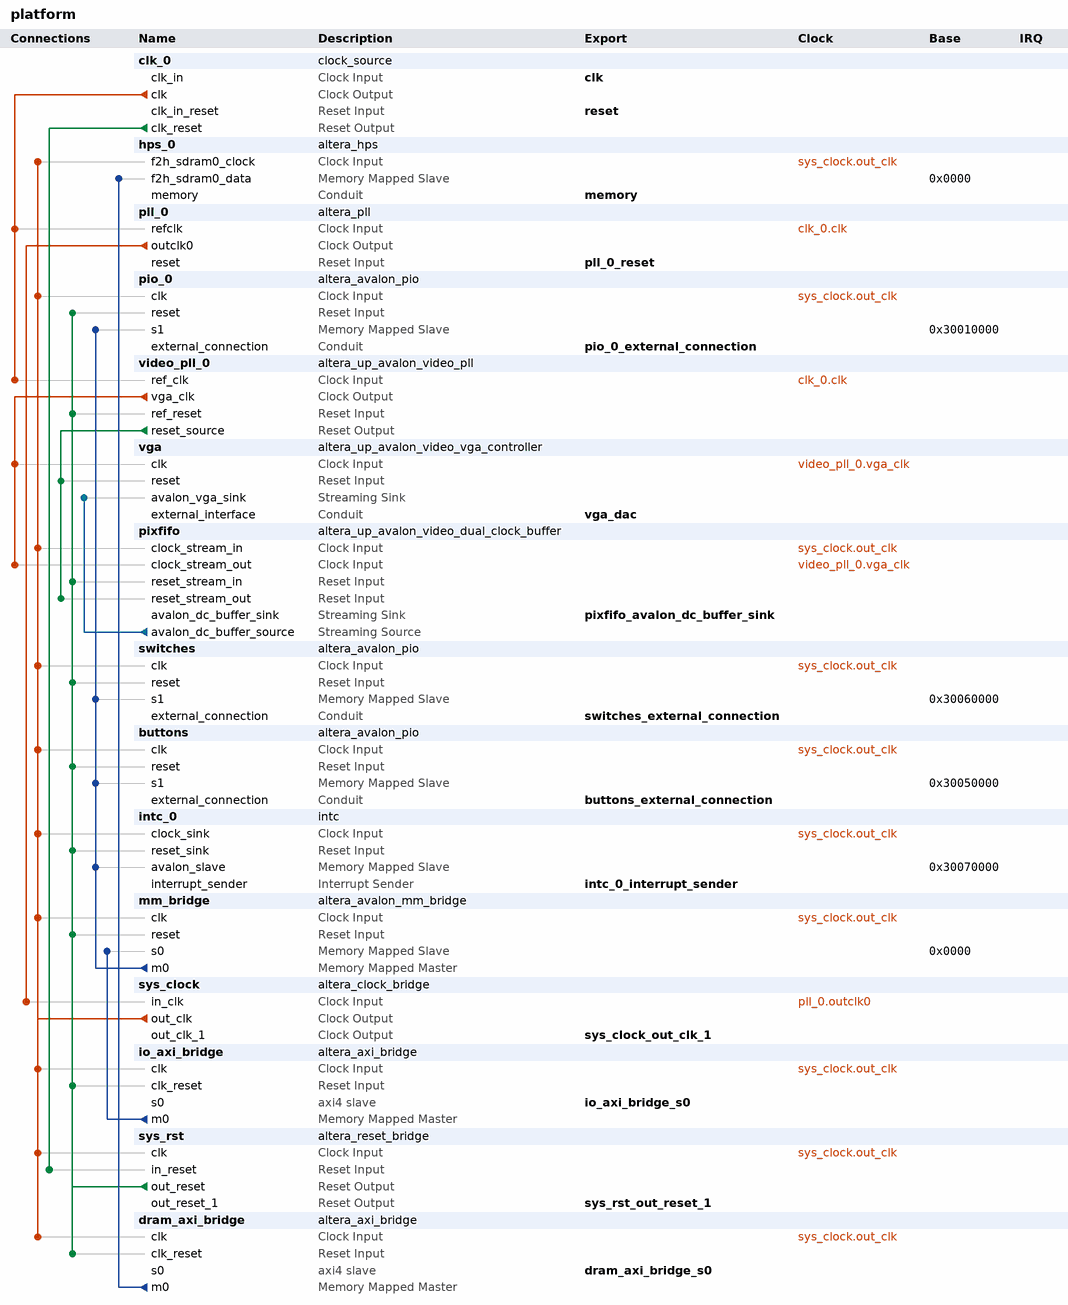
[diagram p0: system contents]
# Platform Designer (Qsys) system platform, Cyclone V 5CSEMA5F31C6
# Parameters at their usual value, and those the tool derives, are not listed.
package require -exact qsys 20.1
create_system platform
set_project_property DEVICE_FAMILY {Cyclone V}
set_project_property DEVICE 5CSEMA5F31C6

add_instance clk_0 clock_source 20.1
set_instance_parameter_value clk_0 clockFrequency 50000000

add_instance hps_0 altera_hps 20.1
set_instance_parameter_value hps_0 EMAC1_Mode N/A
set_instance_parameter_value hps_0 EMAC1_PinMuxing Unused
set_instance_parameter_value hps_0 F2SCLK_COLDRST_Enable false
set_instance_parameter_value hps_0 F2SCLK_DBGRST_Enable false
set_instance_parameter_value hps_0 F2SCLK_WARMRST_Enable false
set_instance_parameter_value hps_0 F2SDRAM_Type AXI-3
set_instance_parameter_value hps_0 F2SDRAM_Width 32
set_instance_parameter_value hps_0 F2SINTERRUPT_Enable false
set_instance_parameter_value hps_0 F2S_Width 0
set_instance_parameter_value hps_0 FPGA_PERIPHERAL_OUTPUT_CLOCK_FREQ_EMAC0_GTX_CLK 125
set_instance_parameter_value hps_0 FPGA_PERIPHERAL_OUTPUT_CLOCK_FREQ_EMAC0_MD_CLK 2.5
set_instance_parameter_value hps_0 FPGA_PERIPHERAL_OUTPUT_CLOCK_FREQ_EMAC1_GTX_CLK 125
set_instance_parameter_value hps_0 FPGA_PERIPHERAL_OUTPUT_CLOCK_FREQ_EMAC1_MD_CLK 2.5
set_instance_parameter_value hps_0 HPS_PROTOCOL DDR3
set_instance_parameter_value hps_0 I2C0_Mode N/A
set_instance_parameter_value hps_0 I2C0_PinMuxing Unused
set_instance_parameter_value hps_0 I2C1_Mode N/A
set_instance_parameter_value hps_0 I2C1_PinMuxing Unused
set_instance_parameter_value hps_0 LWH2F_Enable false
set_instance_parameter_value hps_0 MEM_BANKADDR_WIDTH 3
set_instance_parameter_value hps_0 MEM_CLK_FREQ 300.0
set_instance_parameter_value hps_0 MEM_CLK_FREQ_MAX 400.0
set_instance_parameter_value hps_0 MEM_COL_ADDR_WIDTH 8
set_instance_parameter_value hps_0 MEM_DQ_WIDTH 8
set_instance_parameter_value hps_0 MEM_DRV_STR RZQ/6
set_instance_parameter_value hps_0 MEM_ROW_ADDR_WIDTH 12
set_instance_parameter_value hps_0 MEM_RTT_NOM {ODT Disabled}
set_instance_parameter_value hps_0 MEM_RTT_WR {Dynamic ODT off}
set_instance_parameter_value hps_0 MEM_TCL 7
set_instance_parameter_value hps_0 MEM_TFAW_NS 37.5
set_instance_parameter_value hps_0 MEM_TINIT_US 499
set_instance_parameter_value hps_0 MEM_TMRD_CK 3
set_instance_parameter_value hps_0 MEM_TRAS_NS 40.0
set_instance_parameter_value hps_0 MEM_TRCD_NS 15.0
set_instance_parameter_value hps_0 MEM_TREFI_US 7.0
set_instance_parameter_value hps_0 MEM_TRFC_NS 75.0
set_instance_parameter_value hps_0 MEM_TRP_NS 15.0
set_instance_parameter_value hps_0 MEM_TWTR 2
set_instance_parameter_value hps_0 MEM_VENDOR JEDEC
set_instance_parameter_value hps_0 MEM_WTCL 6
set_instance_parameter_value hps_0 QSPI_Mode N/A
set_instance_parameter_value hps_0 QSPI_PinMuxing Unused
set_instance_parameter_value hps_0 REF_CLK_FREQ 125.0
set_instance_parameter_value hps_0 S2FCLK_USER2CLK 5
set_instance_parameter_value hps_0 S2F_Width 0
set_instance_parameter_value hps_0 SDIO_Mode N/A
set_instance_parameter_value hps_0 SDIO_PinMuxing Unused
set_instance_parameter_value hps_0 SPIM1_Mode N/A
set_instance_parameter_value hps_0 SPIM1_PinMuxing Unused
set_instance_parameter_value hps_0 STM_Enable false
set_instance_parameter_value hps_0 TIMING_BOARD_AC_SKEW 0.02
set_instance_parameter_value hps_0 TIMING_BOARD_AC_TO_CK_SKEW 0.0
set_instance_parameter_value hps_0 TIMING_BOARD_DQ_TO_DQS_SKEW 0.0
set_instance_parameter_value hps_0 TIMING_BOARD_MAX_CK_DELAY 0.6
set_instance_parameter_value hps_0 TIMING_BOARD_MAX_DQS_DELAY 0.6
set_instance_parameter_value hps_0 TIMING_BOARD_SKEW_BETWEEN_DQS 0.02
set_instance_parameter_value hps_0 TIMING_BOARD_SKEW_CKDQS_DIMM_MAX 0.01
set_instance_parameter_value hps_0 TIMING_BOARD_SKEW_CKDQS_DIMM_MIN -0.01
set_instance_parameter_value hps_0 TIMING_BOARD_SKEW_WITHIN_DQS 0.02
set_instance_parameter_value hps_0 TIMING_TDH 125
set_instance_parameter_value hps_0 TIMING_TDQSCK 400
set_instance_parameter_value hps_0 TIMING_TDQSQ 120
set_instance_parameter_value hps_0 TIMING_TDS 50
set_instance_parameter_value hps_0 TIMING_TIH 250
set_instance_parameter_value hps_0 TIMING_TIS 175
set_instance_parameter_value hps_0 TIMING_TQSH 0.38
set_instance_parameter_value hps_0 UART0_Mode N/A
set_instance_parameter_value hps_0 UART0_PinMuxing Unused
set_instance_parameter_value hps_0 USB1_Mode N/A
set_instance_parameter_value hps_0 USB1_PinMuxing Unused
set_instance_parameter_value hps_0 desired_cfg_clk_mhz 100.0
set_instance_parameter_value hps_0 desired_qspi_clk_mhz 400.0

add_instance pll_0 altera_pll 20.1
set_instance_parameter_value pll_0 gui_device_speed_grade 1
set_instance_parameter_value pll_0 gui_number_of_clocks 1
set_instance_parameter_value pll_0 gui_operation_mode direct
set_instance_parameter_value pll_0 gui_output_clock_frequency0 120.0
set_instance_parameter_value pll_0 gui_pll_auto_reset On
set_instance_parameter_value pll_0 gui_pll_mode {Fractional-N PLL}
set_instance_parameter_value pll_0 gui_reference_clock_frequency 50.0
set_instance_parameter_value pll_0 gui_use_locked false

add_instance pio_0 altera_avalon_pio 20.1
set_instance_parameter_value pio_0 bitModifyingOutReg true
set_instance_parameter_value pio_0 direction Output
set_instance_parameter_value pio_0 width 8

add_instance video_pll_0 altera_up_avalon_video_pll 18.0
set_instance_parameter_value video_pll_0 camera {5MP Digital Camera (THDB_D5M)}
set_instance_parameter_value video_pll_0 gui_refclk 50.0
set_instance_parameter_value video_pll_0 lcd {7" LCD on VEEK-MT and MTL/MTL2 Modules}

add_instance vga altera_up_avalon_video_vga_controller 18.0
set_instance_parameter_value vga board DE1-SoC
set_instance_parameter_value vga resolution {VGA 640x480}

add_instance pixfifo altera_up_avalon_video_dual_clock_buffer 18.0
set_instance_parameter_value pixfifo color_bits 10

add_instance switches altera_avalon_pio 20.1
set_instance_parameter_value switches direction Input
set_instance_parameter_value switches width 8

add_instance buttons altera_avalon_pio 20.1
set_instance_parameter_value buttons direction Input
set_instance_parameter_value buttons width 8

add_instance intc_0 intc 1.0

add_instance mm_bridge altera_avalon_mm_bridge 20.1
set_instance_parameter_value mm_bridge ADDRESS_UNITS SYMBOLS
set_instance_parameter_value mm_bridge ADDRESS_WIDTH 32
set_instance_parameter_value mm_bridge DATA_WIDTH 128
set_instance_parameter_value mm_bridge MAX_PENDING_RESPONSES 4
set_instance_parameter_value mm_bridge USE_AUTO_ADDRESS_WIDTH 0

add_instance sys_clock altera_clock_bridge 20.1
set_instance_parameter_value sys_clock DERIVED_CLOCK_RATE 120000000
set_instance_parameter_value sys_clock EXPLICIT_CLOCK_RATE 0
set_instance_parameter_value sys_clock NUM_CLOCK_OUTPUTS 2

add_instance io_axi_bridge altera_axi_bridge 20.1
set_instance_parameter_value io_axi_bridge ADDR_WIDTH 32
set_instance_parameter_value io_axi_bridge AXI_VERSION AXI4
set_instance_parameter_value io_axi_bridge COMBINED_ACCEPTANCE_CAPABILITY 16
set_instance_parameter_value io_axi_bridge COMBINED_ISSUING_CAPABILITY 16
set_instance_parameter_value io_axi_bridge DATA_WIDTH 32
set_instance_parameter_value io_axi_bridge M0_ID_WIDTH 8
set_instance_parameter_value io_axi_bridge READ_ACCEPTANCE_CAPABILITY 16
set_instance_parameter_value io_axi_bridge READ_ADDR_USER_WIDTH 1
set_instance_parameter_value io_axi_bridge READ_DATA_REORDERING_DEPTH 1
set_instance_parameter_value io_axi_bridge READ_DATA_USER_WIDTH 1
set_instance_parameter_value io_axi_bridge READ_ISSUING_CAPABILITY 16
set_instance_parameter_value io_axi_bridge S0_ID_WIDTH 8
set_instance_parameter_value io_axi_bridge USE_M0_ARBURST 1
set_instance_parameter_value io_axi_bridge USE_M0_ARCACHE 1
set_instance_parameter_value io_axi_bridge USE_M0_ARID 1
set_instance_parameter_value io_axi_bridge USE_M0_ARLEN 1
set_instance_parameter_value io_axi_bridge USE_M0_ARLOCK 1
set_instance_parameter_value io_axi_bridge USE_M0_ARQOS 1
set_instance_parameter_value io_axi_bridge USE_M0_ARREGION 1
set_instance_parameter_value io_axi_bridge USE_M0_ARSIZE 1
set_instance_parameter_value io_axi_bridge USE_M0_ARUSER 0
set_instance_parameter_value io_axi_bridge USE_M0_AWBURST 1
set_instance_parameter_value io_axi_bridge USE_M0_AWCACHE 1
set_instance_parameter_value io_axi_bridge USE_M0_AWID 1
set_instance_parameter_value io_axi_bridge USE_M0_AWLEN 1
set_instance_parameter_value io_axi_bridge USE_M0_AWLOCK 1
set_instance_parameter_value io_axi_bridge USE_M0_AWQOS 1
set_instance_parameter_value io_axi_bridge USE_M0_AWREGION 1
set_instance_parameter_value io_axi_bridge USE_M0_AWSIZE 1
set_instance_parameter_value io_axi_bridge USE_M0_AWUSER 0
set_instance_parameter_value io_axi_bridge USE_M0_BID 1
set_instance_parameter_value io_axi_bridge USE_M0_BRESP 1
set_instance_parameter_value io_axi_bridge USE_M0_BUSER 0
set_instance_parameter_value io_axi_bridge USE_M0_RID 1
set_instance_parameter_value io_axi_bridge USE_M0_RLAST 1
set_instance_parameter_value io_axi_bridge USE_M0_RRESP 1
set_instance_parameter_value io_axi_bridge USE_M0_RUSER 0
set_instance_parameter_value io_axi_bridge USE_M0_WSTRB 1
set_instance_parameter_value io_axi_bridge USE_M0_WUSER 0
set_instance_parameter_value io_axi_bridge USE_PIPELINE 1
set_instance_parameter_value io_axi_bridge USE_S0_ARCACHE 1
set_instance_parameter_value io_axi_bridge USE_S0_ARLOCK 1
set_instance_parameter_value io_axi_bridge USE_S0_ARPROT 1
set_instance_parameter_value io_axi_bridge USE_S0_ARQOS 1
set_instance_parameter_value io_axi_bridge USE_S0_ARREGION 1
set_instance_parameter_value io_axi_bridge USE_S0_ARUSER 0
set_instance_parameter_value io_axi_bridge USE_S0_AWCACHE 1
set_instance_parameter_value io_axi_bridge USE_S0_AWLOCK 1
set_instance_parameter_value io_axi_bridge USE_S0_AWPROT 1
set_instance_parameter_value io_axi_bridge USE_S0_AWQOS 1
set_instance_parameter_value io_axi_bridge USE_S0_AWREGION 1
set_instance_parameter_value io_axi_bridge USE_S0_AWUSER 0
set_instance_parameter_value io_axi_bridge USE_S0_BRESP 1
set_instance_parameter_value io_axi_bridge USE_S0_BUSER 0
set_instance_parameter_value io_axi_bridge USE_S0_RRESP 1
set_instance_parameter_value io_axi_bridge USE_S0_RUSER 0
set_instance_parameter_value io_axi_bridge USE_S0_WLAST 1
set_instance_parameter_value io_axi_bridge USE_S0_WUSER 0
set_instance_parameter_value io_axi_bridge WRITE_ACCEPTANCE_CAPABILITY 16
set_instance_parameter_value io_axi_bridge WRITE_ADDR_USER_WIDTH 1
set_instance_parameter_value io_axi_bridge WRITE_DATA_USER_WIDTH 1
set_instance_parameter_value io_axi_bridge WRITE_ISSUING_CAPABILITY 16
set_instance_parameter_value io_axi_bridge WRITE_RESP_USER_WIDTH 1

add_instance sys_rst altera_reset_bridge 20.1
set_instance_parameter_value sys_rst ACTIVE_LOW_RESET 1
set_instance_parameter_value sys_rst NUM_RESET_OUTPUTS 2
set_instance_parameter_value sys_rst SYNCHRONOUS_EDGES deassert

add_instance dram_axi_bridge altera_axi_bridge 20.1
set_instance_parameter_value dram_axi_bridge ADDR_WIDTH 32
set_instance_parameter_value dram_axi_bridge AXI_VERSION AXI4
set_instance_parameter_value dram_axi_bridge COMBINED_ACCEPTANCE_CAPABILITY 16
set_instance_parameter_value dram_axi_bridge COMBINED_ISSUING_CAPABILITY 16
set_instance_parameter_value dram_axi_bridge DATA_WIDTH 32
set_instance_parameter_value dram_axi_bridge M0_ID_WIDTH 8
set_instance_parameter_value dram_axi_bridge READ_ACCEPTANCE_CAPABILITY 16
set_instance_parameter_value dram_axi_bridge READ_ADDR_USER_WIDTH 1
set_instance_parameter_value dram_axi_bridge READ_DATA_REORDERING_DEPTH 1
set_instance_parameter_value dram_axi_bridge READ_DATA_USER_WIDTH 1
set_instance_parameter_value dram_axi_bridge READ_ISSUING_CAPABILITY 16
set_instance_parameter_value dram_axi_bridge S0_ID_WIDTH 8
set_instance_parameter_value dram_axi_bridge USE_M0_ARBURST 1
set_instance_parameter_value dram_axi_bridge USE_M0_ARCACHE 1
set_instance_parameter_value dram_axi_bridge USE_M0_ARID 1
set_instance_parameter_value dram_axi_bridge USE_M0_ARLEN 1
set_instance_parameter_value dram_axi_bridge USE_M0_ARLOCK 1
set_instance_parameter_value dram_axi_bridge USE_M0_ARQOS 0
set_instance_parameter_value dram_axi_bridge USE_M0_ARREGION 1
set_instance_parameter_value dram_axi_bridge USE_M0_ARSIZE 1
set_instance_parameter_value dram_axi_bridge USE_M0_ARUSER 0
set_instance_parameter_value dram_axi_bridge USE_M0_AWBURST 1
set_instance_parameter_value dram_axi_bridge USE_M0_AWCACHE 1
set_instance_parameter_value dram_axi_bridge USE_M0_AWID 1
set_instance_parameter_value dram_axi_bridge USE_M0_AWLEN 1
set_instance_parameter_value dram_axi_bridge USE_M0_AWLOCK 1
set_instance_parameter_value dram_axi_bridge USE_M0_AWQOS 0
set_instance_parameter_value dram_axi_bridge USE_M0_AWREGION 0
set_instance_parameter_value dram_axi_bridge USE_M0_AWSIZE 1
set_instance_parameter_value dram_axi_bridge USE_M0_AWUSER 0
set_instance_parameter_value dram_axi_bridge USE_M0_BID 1
set_instance_parameter_value dram_axi_bridge USE_M0_BRESP 1
set_instance_parameter_value dram_axi_bridge USE_M0_BUSER 0
set_instance_parameter_value dram_axi_bridge USE_M0_RID 1
set_instance_parameter_value dram_axi_bridge USE_M0_RLAST 1
set_instance_parameter_value dram_axi_bridge USE_M0_RRESP 1
set_instance_parameter_value dram_axi_bridge USE_M0_RUSER 0
set_instance_parameter_value dram_axi_bridge USE_M0_WSTRB 1
set_instance_parameter_value dram_axi_bridge USE_M0_WUSER 0
set_instance_parameter_value dram_axi_bridge USE_PIPELINE 1
set_instance_parameter_value dram_axi_bridge USE_S0_ARCACHE 0
set_instance_parameter_value dram_axi_bridge USE_S0_ARLOCK 0
set_instance_parameter_value dram_axi_bridge USE_S0_ARPROT 0
set_instance_parameter_value dram_axi_bridge USE_S0_ARQOS 0
set_instance_parameter_value dram_axi_bridge USE_S0_ARREGION 0
set_instance_parameter_value dram_axi_bridge USE_S0_ARUSER 0
set_instance_parameter_value dram_axi_bridge USE_S0_AWCACHE 0
set_instance_parameter_value dram_axi_bridge USE_S0_AWLOCK 0
set_instance_parameter_value dram_axi_bridge USE_S0_AWPROT 0
set_instance_parameter_value dram_axi_bridge USE_S0_AWQOS 0
set_instance_parameter_value dram_axi_bridge USE_S0_AWREGION 0
set_instance_parameter_value dram_axi_bridge USE_S0_AWUSER 0
set_instance_parameter_value dram_axi_bridge USE_S0_BRESP 1
set_instance_parameter_value dram_axi_bridge USE_S0_BUSER 0
set_instance_parameter_value dram_axi_bridge USE_S0_RRESP 1
set_instance_parameter_value dram_axi_bridge USE_S0_RUSER 0
set_instance_parameter_value dram_axi_bridge USE_S0_WLAST 1
set_instance_parameter_value dram_axi_bridge USE_S0_WUSER 0
set_instance_parameter_value dram_axi_bridge WRITE_ACCEPTANCE_CAPABILITY 16
set_instance_parameter_value dram_axi_bridge WRITE_ADDR_USER_WIDTH 1
set_instance_parameter_value dram_axi_bridge WRITE_DATA_USER_WIDTH 1
set_instance_parameter_value dram_axi_bridge WRITE_ISSUING_CAPABILITY 16
set_instance_parameter_value dram_axi_bridge WRITE_RESP_USER_WIDTH 1

# connections
add_connection clk_0.clk pll_0.refclk clock
add_connection clk_0.clk video_pll_0.ref_clk clock
add_connection pll_0.outclk0 sys_clock.in_clk clock
add_connection sys_clock.out_clk buttons.clk clock
add_connection sys_clock.out_clk dram_axi_bridge.clk clock
add_connection sys_clock.out_clk hps_0.f2h_sdram0_clock clock
add_connection sys_clock.out_clk intc_0.clock_sink clock
add_connection sys_clock.out_clk io_axi_bridge.clk clock
add_connection sys_clock.out_clk mm_bridge.clk clock
add_connection sys_clock.out_clk pio_0.clk clock
add_connection sys_clock.out_clk pixfifo.clock_stream_in clock
add_connection sys_clock.out_clk switches.clk clock
add_connection sys_clock.out_clk sys_rst.clk clock
add_connection video_pll_0.vga_clk pixfifo.clock_stream_out clock
add_connection video_pll_0.vga_clk vga.clk clock
add_connection clk_0.clk_reset sys_rst.in_reset reset
add_connection sys_rst.out_reset buttons.reset reset
add_connection sys_rst.out_reset dram_axi_bridge.clk_reset reset
add_connection sys_rst.out_reset intc_0.reset_sink reset
add_connection sys_rst.out_reset io_axi_bridge.clk_reset reset
add_connection sys_rst.out_reset mm_bridge.reset reset
add_connection sys_rst.out_reset pio_0.reset reset
add_connection sys_rst.out_reset pixfifo.reset_stream_in reset
add_connection sys_rst.out_reset switches.reset reset
add_connection sys_rst.out_reset video_pll_0.ref_reset reset
add_connection video_pll_0.reset_source pixfifo.reset_stream_out reset
add_connection video_pll_0.reset_source vga.reset reset
add_connection dram_axi_bridge.m0 hps_0.f2h_sdram0_data avalon
set_connection_parameter_value dram_axi_bridge.m0/hps_0.f2h_sdram0_data baseAddress 0x0000
add_connection io_axi_bridge.m0 mm_bridge.s0 avalon
set_connection_parameter_value io_axi_bridge.m0/mm_bridge.s0 baseAddress 0x0000
add_connection mm_bridge.m0 buttons.s1 avalon
set_connection_parameter_value mm_bridge.m0/buttons.s1 baseAddress 0x30050000
add_connection mm_bridge.m0 intc_0.avalon_slave avalon
set_connection_parameter_value mm_bridge.m0/intc_0.avalon_slave baseAddress 0x30070000
add_connection mm_bridge.m0 pio_0.s1 avalon
set_connection_parameter_value mm_bridge.m0/pio_0.s1 baseAddress 0x30010000
add_connection mm_bridge.m0 switches.s1 avalon
set_connection_parameter_value mm_bridge.m0/switches.s1 baseAddress 0x30060000
add_connection pixfifo.avalon_dc_buffer_source vga.avalon_vga_sink avalon_streaming

# exported interfaces
add_interface buttons_external_connection conduit end
set_interface_property buttons_external_connection EXPORT_OF buttons.external_connection
add_interface clk clock sink
set_interface_property clk EXPORT_OF clk_0.clk_in
add_interface dram_axi_bridge_s0 axi4 slave
set_interface_property dram_axi_bridge_s0 EXPORT_OF dram_axi_bridge.s0
add_interface intc_0_interrupt_sender interrupt sender
set_interface_property intc_0_interrupt_sender EXPORT_OF intc_0.interrupt_sender
add_interface io_axi_bridge_s0 axi4 slave
set_interface_property io_axi_bridge_s0 EXPORT_OF io_axi_bridge.s0
add_interface memory conduit end
set_interface_property memory EXPORT_OF hps_0.memory
add_interface pio_0_external_connection conduit end
set_interface_property pio_0_external_connection EXPORT_OF pio_0.external_connection
add_interface pixfifo_avalon_dc_buffer_sink avalon_streaming sink
set_interface_property pixfifo_avalon_dc_buffer_sink EXPORT_OF pixfifo.avalon_dc_buffer_sink
add_interface pll_0_reset reset sink
set_interface_property pll_0_reset EXPORT_OF pll_0.reset
add_interface reset reset sink
set_interface_property reset EXPORT_OF clk_0.clk_in_reset
add_interface switches_external_connection conduit end
set_interface_property switches_external_connection EXPORT_OF switches.external_connection
add_interface sys_clock_out_clk_1 clock source
set_interface_property sys_clock_out_clk_1 EXPORT_OF sys_clock.out_clk_1
add_interface sys_rst_out_reset_1 reset source
set_interface_property sys_rst_out_reset_1 EXPORT_OF sys_rst.out_reset_1
add_interface vga_dac conduit end
set_interface_property vga_dac EXPORT_OF vga.external_interface

set_interconnect_requirement {$system} qsys_mm.clockCrossingAdapter HANDSHAKE
set_interconnect_requirement {$system} qsys_mm.enableEccProtection FALSE
set_interconnect_requirement {$system} qsys_mm.enableInstrumentation FALSE
set_interconnect_requirement {$system} qsys_mm.insertDefaultSlave FALSE
set_interconnect_requirement {$system} qsys_mm.maxAdditionalLatency 1

save_system platform.qsys
